# EasyEDA schematic SCH_mpu6050_2024-04-15.json
TITLE: Sheet_1; REV: 1.0; Date: 2024-03-22; Sheet: 1/1; Drawn By: gtrishanu; Company: Your Company
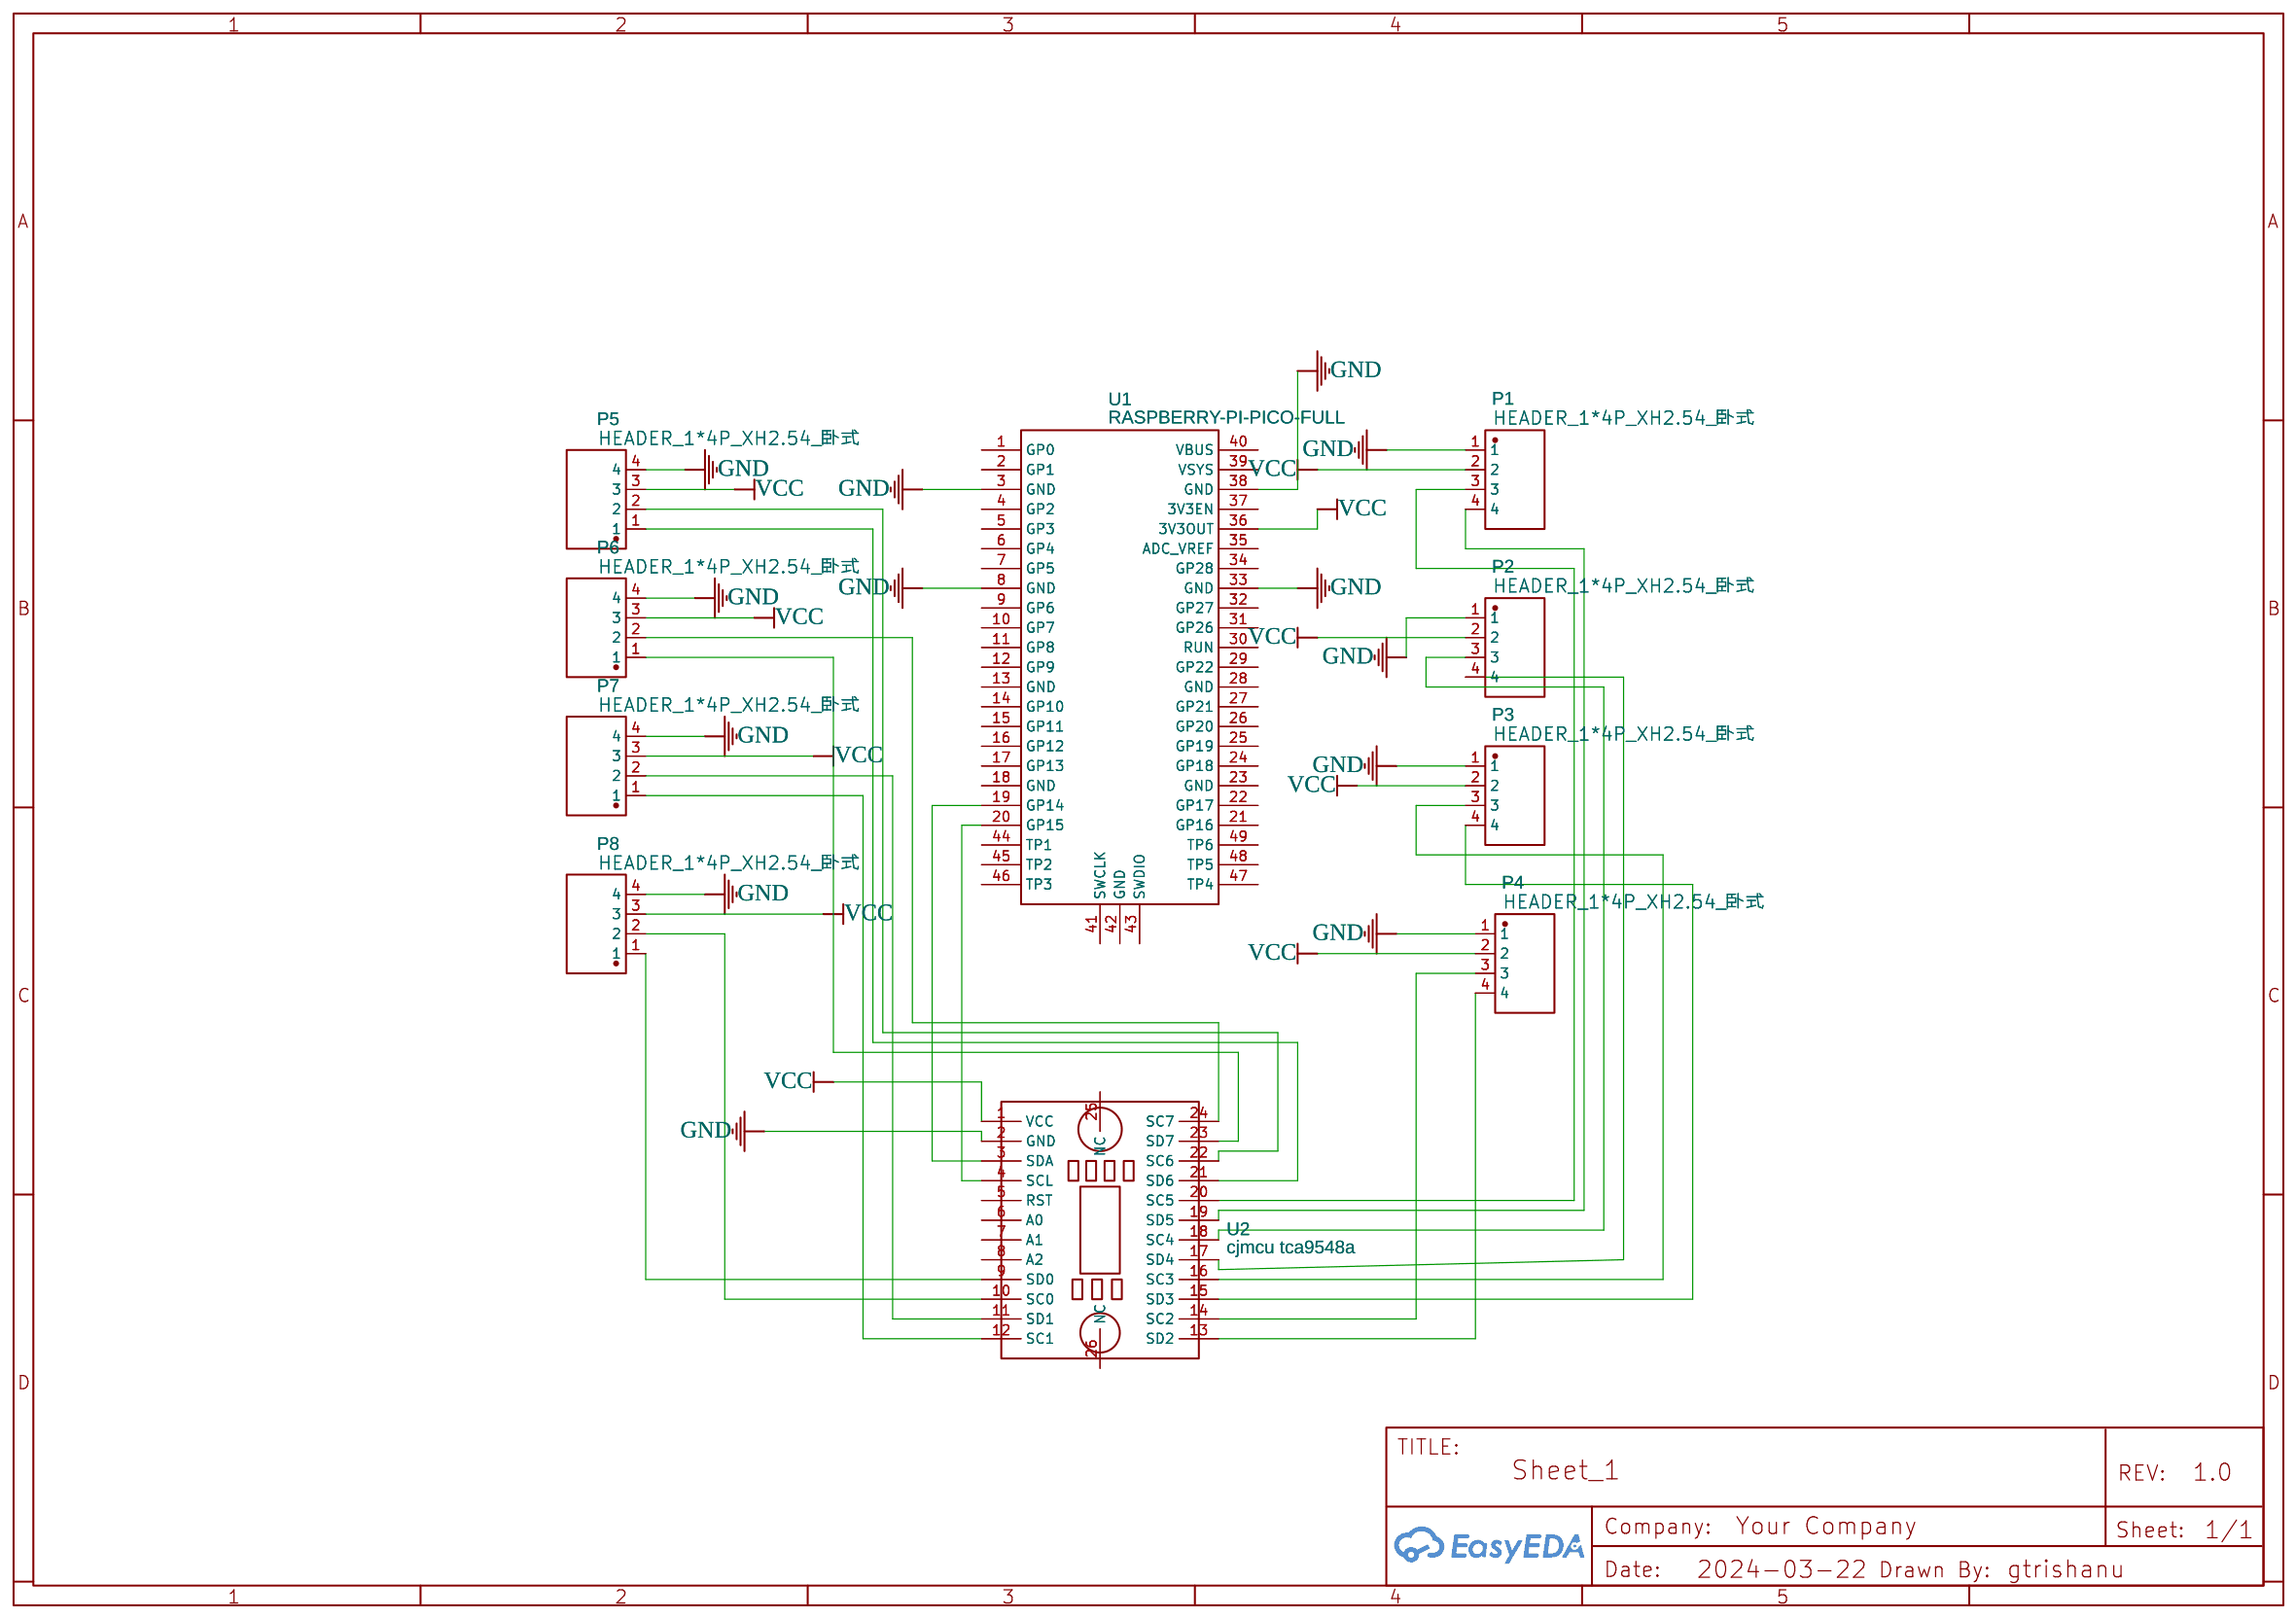
[diagram p0: schematic sheet]

## Parts
P1  HEADER_1*4P_XH2.54_卧式  [HDR-TH_4P-P2.54-H-M-W11.0]
P2  HEADER_1*4P_XH2.54_卧式  [HDR-TH_4P-P2.54-H-M-W11.0]
P3  HEADER_1*4P_XH2.54_卧式  [HDR-TH_4P-P2.54-H-M-W11.0]
P4  HEADER_1*4P_XH2.54_卧式  [HDR-TH_4P-P2.54-H-M-W11.0]
P5  HEADER_1*4P_XH2.54_卧式  [HDR-TH_4P-P2.54-H-M-W11.0]
P6  HEADER_1*4P_XH2.54_卧式  [HDR-TH_4P-P2.54-H-M-W11.0]
P7  HEADER_1*4P_XH2.54_卧式  [HDR-TH_4P-P2.54-H-M-W11.0]
P8  HEADER_1*4P_XH2.54_卧式  [HDR-TH_4P-P2.54-H-M-W11.0]
U1  RASPBERRY-PI-PICO-FULL  [RASPBERRY-PI-PICO-FULL-ROMAN]
U2  cjmcu tca9548a  [CJMCU-TCA9548A]

## Library data of the parts
P1-P8 = HEADER_1*4P_XH2.54_卧式: Contributor: LCSC; Supplier: LCSC; Supplier Part: C9900003188; Manufacturer: null; JLCPCB Part Class: Extended Part; link: https://lcsc.com/eda_search?q=C9900003188&%26type=1&ref=editor
U1 = RASPBERRY-PI-PICO-FULL: Manufacturer: Raspberry Pi Foundation; Manufacturer Part: Raspberry Pi Pico; Supplier: Element14; Contributor: yakimovroman1982
U2 = cjmcu tca9548a: Contributor: shao0508

## Nets
GND: P1.1 P2.1 P3.1 P4.1 P5.4 P6.4 P7.4 P8.4 U1.3(GND) U1.8(GND) U1.33(GND) U1.38(GND) U2.2(GND)
VCC: P1.2 P2.2 P3.2 P4.2 P5.3 P6.3 P7.3 P8.3 U1.36(3V3OUT) U2.1(VCC)
Net-(P1-3): P1.3 U2.20(SC5)
Net-(P1-4): P1.4 U2.19(SD5)
Net-(P2-3): P2.3 U2.18(SC4)
Net-(P2-4): P2.4 U2.17(SD4)
Net-(P3-3): P3.3 U2.16(SC3)
Net-(P3-4): P3.4 U2.15(SD3)
Net-(P4-3): P4.3 U2.14(SC2)
Net-(P4-4): P4.4 U2.13(SD2)
Net-(P5-1): P5.1 U2.21(SD6)
Net-(P5-2): P5.2 U2.22(SC6)
Net-(P6-1): P6.1 U2.23(SD7)
Net-(P6-2): P6.2 U2.24(SC7)
Net-(P7-1): P7.1 U2.12(SC1)
Net-(P7-2): P7.2 U2.11(SD1)
Net-(P8-1): P8.1 U2.9(SD0)
Net-(P8-2): P8.2 U2.10(SC0)
Net-(U1-19): U1.19(GP14) U2.3(SDA)
Net-(U1-20): U1.20(GP15) U2.4(SCL)

Not connected (* = marked no-connect by the designer): U1 1(GP0) 2(GP1) 4(GP2) 5(GP3) 6(GP4) 7(GP5) 9(GP6) 10(GP7) 11(GP8) 12(GP9) 13(GND) 14(GP10) 15(GP11) 16(GP12) 17(GP13) 18(GND) 21(GP16) 22(GP17) 23(GND) 24(GP18) 25(GP19) 26(GP20) 27(GP21) 28(GND) 29(GP22) 30(RUN) 31(GP26) 32(GP27) 34(GP28) 35(ADC_VREF) 37(3V3EN) 39(VSYS) 40(VBUS) 41(SWCLK) 42(GND) 43(SWDIO) 44(TP1) 45(TP2) 46(TP3) 47(TP4) 48(TP5) 49(TP6); U2 5(RST) 6(A0) 7(A1) 8(A2) 25(NC) 26(NC)
